# Altium project Drude.PrjPcb
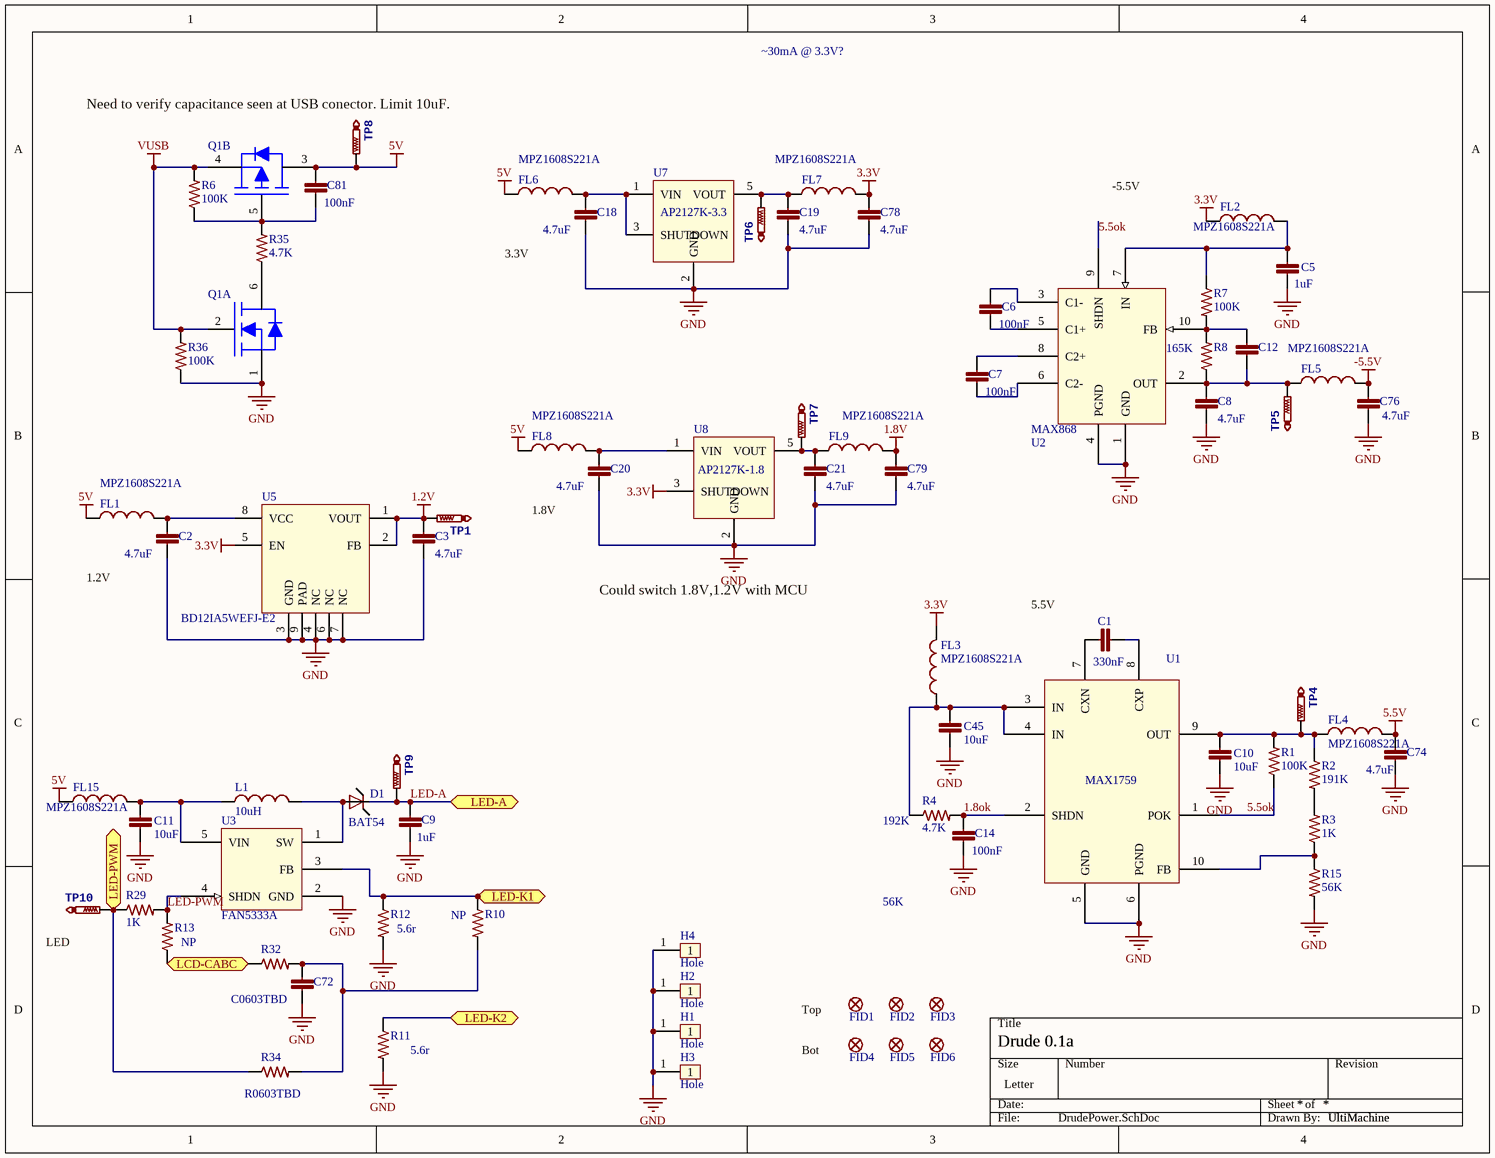
[diagram p0: DrudePower.SchDoc]
projectDesigner: UltiMachine; projectTitle: Drude; projectVersion: 0.1a
5 sheets, 217 parts. Net scope: flat (ports and power ports of the same name join across sheets).
Board file: Drude02.PcbDoc
Sheets:
  DrudePower.SchDoc
  LCD-Touch.SchDoc
  MCU.SchDoc
  TC358779XBG.SchDoc
  HDMI.SchDoc

## Sheet DrudePower.SchDoc
size Letter

### Parts
C1  330nF  [C0603]
C2  4.7uF  [C0603]
C3  4.7uF  [C0603]
C5  1uF  [C0603]
C6  100nF  [C0603]
C7  100nF  [C0603]
C8  4.7uF  [C0603]
C9  1uF  [C0805]
C10  10uF  [C0805]
C11  10uF  [C0805]
C12  (no value)  [C0603]
C14  100nF  [C0603]
C18  4.7uF  [C0603]
C19  4.7uF  [C0603]
C20  4.7uF  [C0603]
C21  4.7uF  [C0603]
C45  10uF  [C0805]
C72  C0603TBD  [C0603]
C74  4.7uF  [C0603]
C76  4.7uF  [C0603]
C78  4.7uF  [C0603]
C79  4.7uF  [C0603]
C81  100nF  [C0402]
D1  BAT54  [SOD523]
FID1  FIDUCIAL  [FIDUCIAL-1X2]  (value not drawn)
FID2  FIDUCIAL  [FIDUCIAL-1X2]  (value not drawn)
FID3  FIDUCIAL  [FIDUCIAL-1X2]  (value not drawn)
FID4  FIDUCIAL  [FIDUCIAL-1X2]  (value not drawn)
FID5  FIDUCIAL  [FIDUCIAL-1X2]  (value not drawn)
FID6  FIDUCIAL  [FIDUCIAL-1X2]  (value not drawn)
FL1  MPZ1608S221A  [C0603]
FL2  MPZ1608S221A  [C0603]
FL3  MPZ1608S221A  [C0603]
FL4  MPZ1608S221A  [C0603]
FL5  MPZ1608S221A  [C0603]
FL6  MPZ1608S221A  [C0603]
FL7  MPZ1608S221A  [C0603]
FL8  MPZ1608S221A  [C0603]
FL9  MPZ1608S221A  [C0603]
FL15  MPZ1608S221A  [C0603]
H1  Hole  [Standoff3mm]  (no BOM)
H2  Hole  [Standoff3mm]  (no BOM)
H3  Hole  [Standoff3mm]  (no BOM)
H4  Hole  [Standoff3mm]  (no BOM)
L1  10uH  [INDP3027X15L]
Q1  DMC2400UV  [SOT563-FL50P162X170-6N]  (value not drawn)  (parts A,B of 2)
R1  100K  [R0603]
R2  191K  [R0603]
R3  1K  [R0603]
R4  4.7K  [R0603]
R6  100K  [R0402]
R7  100K  [R0402]
R8  165K  [R0402]
R10  (no value)  [R0603]
R11  (no value)  [R0603]
R12  (no value)  [R0603]
R13  (no value)  [R0603]
R15  56K  [R0603]
R29  1K  [R0603]
R32  (no value)  [R0603]
R34  R0603TBD  [R0603]
R35  4.7K  [R0603]
R36  100K  [R0402]
TP1  TestPoint  [TP1-27]  (value not drawn)  (no BOM)
TP4  TestPoint  [TP1-27]  (value not drawn)  (no BOM)
TP5  TestPoint  [TP1-27]  (value not drawn)  (no BOM)
TP6  TestPoint  [TP1-27]  (value not drawn)  (no BOM)
TP7  TestPoint  [TP1-27]  (value not drawn)  (no BOM)
TP8  TestPoint  [TP1-27]  (value not drawn)  (no BOM)
TP9  TestPoint  [TP1-27]  (value not drawn)  (no BOM)
TP10  TestPoint  [TP1-27]  (value not drawn)  (no BOM)
U1  MAX1759  [TSSOP50P490X109-10L]
U2  MAX868  [TSSOP50P490X109-10L]
U3  FAN5333A  [SOT95P270X145-5L]
U5  BD12IA5WEFJ-E2  [TSOP-HTSOP-J8-127P600X100_HS-9M]
U7  AP2127K-3.3  [SOT23-5P285X140-5L]
U8  AP2127K-1.8  [SOT23-5P285X140-5L]

### Ports
LCD-CABC, LED-A, LED-K1, LED-K2, LED-PWM

### Nets
1.2V: C3.1 TP1.TP U5.1(VOUT) U5.2(FB)
1.8V: C79.1 FL9.2
3.3V: C78.1 FL2.1 FL3.2 FL7.2 U5.5(EN) U8.3(SHUTDOWN)
5.5V: C74.1 FL4.2
5V: C81.1 FL1.1 FL6.1 FL8.1 FL15.1 Q1.3(D2) TP8.TP
-5.5V: C76.1 FL5.2
GND: C2.2 C3.2 C5.2 C8.2 C9.2 C10.2 C11.2 C14.2 C18.2 C19.2 C20.2 C21.2 C45.2 C72.2 C74.2 C76.2 C78.2 C79.2 H1.1 H2.1 H3.1 H4.1 Q1.1(S1) R11.2 R12.2 R15.2 R36.1 U1.5(GND) U1.6(PGND) U2.1(GND) U2.4(PGND) U3.2(GND) U5.3(GND) U5.4(NC) U5.6(NC) U5.7(NC) U5.9(PAD) U7.2(GND) U8.2(GND)
VUSB: Q1.2(G1) Q1.4(S2) R6.2 R36.2
1.8ok: C14.1 R4.2 U1.2(SHDN)
5.5ok: R1.1 U1.1(POK) U2.9(SHDN)
LED-A: C9.1 D1.C TP9.TP ; port LED-A
LED-K1: R10.1 R12.1 U3.3(FB) ; port LED-K1
LED-K2: R11.1 ; port LED-K2
LED-PWM: R13.2 R29.2 U3.4(SHDN)
NetC1_1: C1.1 U1.7(CXN)
NetC1_2: C1.2 U1.8(CXP)
NetC2_1: C2.1 FL1.2 U5.8(VCC)
NetC5_1: C5.1 FL2.2 R7.1 U2.7(IN)
NetC6_1: C6.1 U2.3(C1-)
NetC6_2: C6.2 U2.5(C1+)
NetC7_1: C7.1 U2.8(C2+)
NetC7_2: C7.2 U2.6(C2-)
NetC8_1: C8.1 C12.2 FL5.1 R8.1 TP5.TP U2.2(OUT)
NetC10_1: C10.1 FL4.1 R1.2 R2.1 TP4.TP U1.9(OUT)
NetC11_1: C11.1 FL15.2 L1.1 U3.5(VIN)
NetC12_1: C12.1 R7.2 R8.2 U2.10(FB)
NetC18_1: C18.1 FL6.2 U7.1(VIN) U7.3(SHUTDOWN)
NetC19_1: C19.1 FL7.1 TP6.TP U7.5(VOUT)
NetC20_1: C20.1 FL8.2 U8.1(VIN)
NetC21_1: C21.1 FL9.1 TP7.TP U8.5(VOUT)
NetC45_1: C45.1 FL3.1 R4.1 U1.3(IN) U1.4(IN)
NetC72_1: C72.1 R10.2 R32.2 R34.2
NetC81_2: C81.2 Q1.5(G2) R6.1 R35.2
NetD1_A: D1.A L1.2 U3.1(SW)
NetJ5_32: R13.1 R32.1 ; port LCD-CABC
NetQ1_6: Q1.6(D1) R35.1
NetR2_2: R2.2 R3.2
NetR3_1: R3.1 R15.1 U1.10(FB)
NetR29_1: R29.1 R34.1 TP10.TP ; port LED-PWM

### Notes on the sheet
- ~30mA @ 3.3V?
- Need to verify capacitance seen at USB conector. Limit 10uF.
- -5.5V
- 3.3V
- 1.8V
- 1.2V
- Could switch 1.8V,1.2V with MCU
- 5.5V
- (near R4) 192K
- 56K
- LED
- (near R13) NP
- (near R12) 5.6r
- (near R10) NP
- Top
- (near R11) 5.6r
- Bot

### Library data of the parts
C1 = C1608X7R1H334K080AC: CAP CER 0603 330nF 50V 10% X7R; LastRevisionNote: ImportComponents; Published: 23-Apr-2014; Publisher: UltiMachine; LastRevisionDate: 23-Apr-2014; ManufacturerPartNumber: C1608X7R1H334K080AC; VALUE: 330nF
C2 C3 C8 C18-C21 C74 C76 C78 C79 = GRM188R61A475KE15D: CAP CER 4.7UF 10V X5R 0603; LastRevisionNote: ImportComponents; Published: 23-Apr-2014; Publisher: UltiMachine; LastRevisionDate: 23-Apr-2014; ManufacturerPartNumber: GRM188R61A475KE15D; VALUE: 4.7uF
C5 = CC0603ZRY5V6BB105: CAP CER 0603 1uF 10V Y5V; LastRevisionNote: ImportComponents; Published: 23-Apr-2014; Publisher: UltiMachine; LastRevisionDate: 23-Apr-2014; ManufacturerPartNumber: CC0603ZRY5V6BB105; VALUE: 1uF
C6 C7 C14 = C0603C104K5RACTU: CAP CER 0603 100nF 50V 10% X7R; LastRevisionNote: ImportComponents; Published: 23-Apr-2014; Publisher: UltiMachine; LastRevisionDate: 23-Apr-2014; ManufacturerPartNumber: C0603C104K5RACTU; VALUE: 100nF
C9 = GRM21BR71H105KA12L: CAP CER 0805 1uF 50V 10% X7R; LastRevisionNote: ImportComponents; Published: 23-Apr-2014; Publisher: UltiMachine; LastRevisionDate: 23-Apr-2014; ManufacturerPartNumber: GRM21BR71H105KA12L; VALUE: 1uF
C10 C11 C45 = C0805C106K8PACTU: CAP CER 0805 10uF 10V 10% X5R; LastRevisionNote: ImportComponents; Published: 23-Apr-2014; Publisher: UltiMachine; LastRevisionDate: 23-Apr-2014; ManufacturerPartNumber: C0805C106K8PACTU; VALUE: 10uF
C12 = Capacitor: Capacitor Non Polarized; LastRevisionNote: ImportComponents; Published: 23-Apr-2014; Publisher: UltiMachine; LastRevisionDate: 23-Apr-2014
C72 = C0603TBD: Capacitor Non Polarized; LastRevisionNote: ImportComponents; Published: 23-Apr-2014; Publisher: UltiMachine; LastRevisionDate: 23-Apr-2014; VALUE: C0603TBD
C81 = GRM155R71C104KA88D: CAP CER 0402 100nF 16V 10% X7R; LastRevisionNote: ImportComponents; Published: 23-Apr-2014; Publisher: UltiMachine; LastRevisionDate: 23-Apr-2014; ManufacturerPartNumber: GRM155R71C104KA88D; VALUE: 100nF
D1 = BAT54XV2: Diode Schottky 30V 200mA
FID1-FID6 = FIDUCIAL: LastRevisionNote: ImportComponents; Published: 23-Apr-2014; Publisher: UltiMachine; LastRevisionDate: 23-Apr-2014
FL1-FL9 FL15 = MPZ1608S221A: Ferrite; LastRevisionNote: ImportComponents; Published: 23-Apr-2014; Publisher: UltiMachine; LastRevisionDate: 23-Apr-2014; Value: MPZ1608S221A
H1-H4 = Standoff3mm: Mechanical - Top connect
L1 = SRN3015-100M: Ind 10uH 1A
Q1 = DMC2400UV: Mosfet Complementary Pair N +P
R1 = RC0603FR-07100KL: RES 100K OHM 1/10W 1% 0603 SMD; LastRevisionNote: ImportComponents; Published: 23-Apr-2014; Publisher: UltiMachine; LastRevisionDate: 23-Apr-2014; ManufacturerPartNumber: RC0603FR-07100KL; VALUE: 100K
R2 = RC0603FR-07191KL: RES 191K OHM 1% 1/10W 0603 SMD; LastRevisionNote: ImportComponents; Published: 23-Apr-2014; Publisher: UltiMachine; LastRevisionDate: 23-Apr-2014; ManufacturerPartNumber: RC0603FR-07191KL; VALUE: 191K
R3 R29 = ERJ-3EKF1001V: RES 0603 1K 100mW 1%; LastRevisionNote: ImportComponents; Published: 23-Apr-2014; Publisher: UltiMachine; LastRevisionDate: 23-Apr-2014; ManufacturerPartNumber: ERJ-3EKF1001V; VALUE: 1K
R4 R35 = ERJ3EKF4701V: RES 0603 4.7K 100mW 1%; LastRevisionNote: ImportComponents; Published: 23-Apr-2014; Publisher: UltiMachine; LastRevisionDate: 23-Apr-2014; ManufacturerPartNumber: ERJ3EKF4701V; VALUE: 4.7K
R6 R7 R36 = RC0402FR-07100KL: RES 100K OHM 1% 1/16W 0402; LastRevisionNote: ImportComponents; Published: 23-Apr-2014; Publisher: UltiMachine; LastRevisionDate: 23-Apr-2014; VALUE: 100K
R8 = CRCW0402165KFKED: RES 165K OHM 1% 1/16W 0402; LastRevisionNote: ImportComponents; Published: 23-Apr-2014; Publisher: UltiMachine; LastRevisionDate: 23-Apr-2014; VALUE: 165K
R10-R13 R32 = Resistor: LastRevisionNote: ImportComponents; Published: 23-Apr-2014; Publisher: UltiMachine; LastRevisionDate: 23-Apr-2014
R15 = RC0603FR-0756KL: RES 56K OHM 1% 1/10W 0603 56K; LastRevisionNote: ImportComponents; Published: 23-Apr-2014; Publisher: UltiMachine; LastRevisionDate: 23-Apr-2014; ManufacturerPartNumber: RC0603FR-0756KL; VALUE: 56K
R34 = R0603TBD: Resistor; LastRevisionNote: ImportComponents; Published: 23-Apr-2014; Publisher: UltiMachine; LastRevisionDate: 23-Apr-2014; VALUE: R0603TBD
TP1 TP4-TP10 = TestPoint: Test Point; LastRevisionNote: ImportComponents; Published: 23-Apr-2014; Publisher: UltiMachine; LastRevisionDate: 23-Apr-2014
U1 = MAX1759: Buck/Boost Regulating Charge Pump
U2 = MAX868: Regulated -2x Inverting Charge Pump
U3 = FAN5333: LED Driver w/ integrated switch
U5 = BD12IA5WEFJ-E2: LDO Regulator 500mA 1.2V
U7 = AP2127K-3.3TRG1: LDO 3.3V 0.3A SOT25
U8 = AP2127K-1.8TRG1: LDO 1.8V 0.3A SOT25

## Sheet LCD-Touch.SchDoc
size Letter
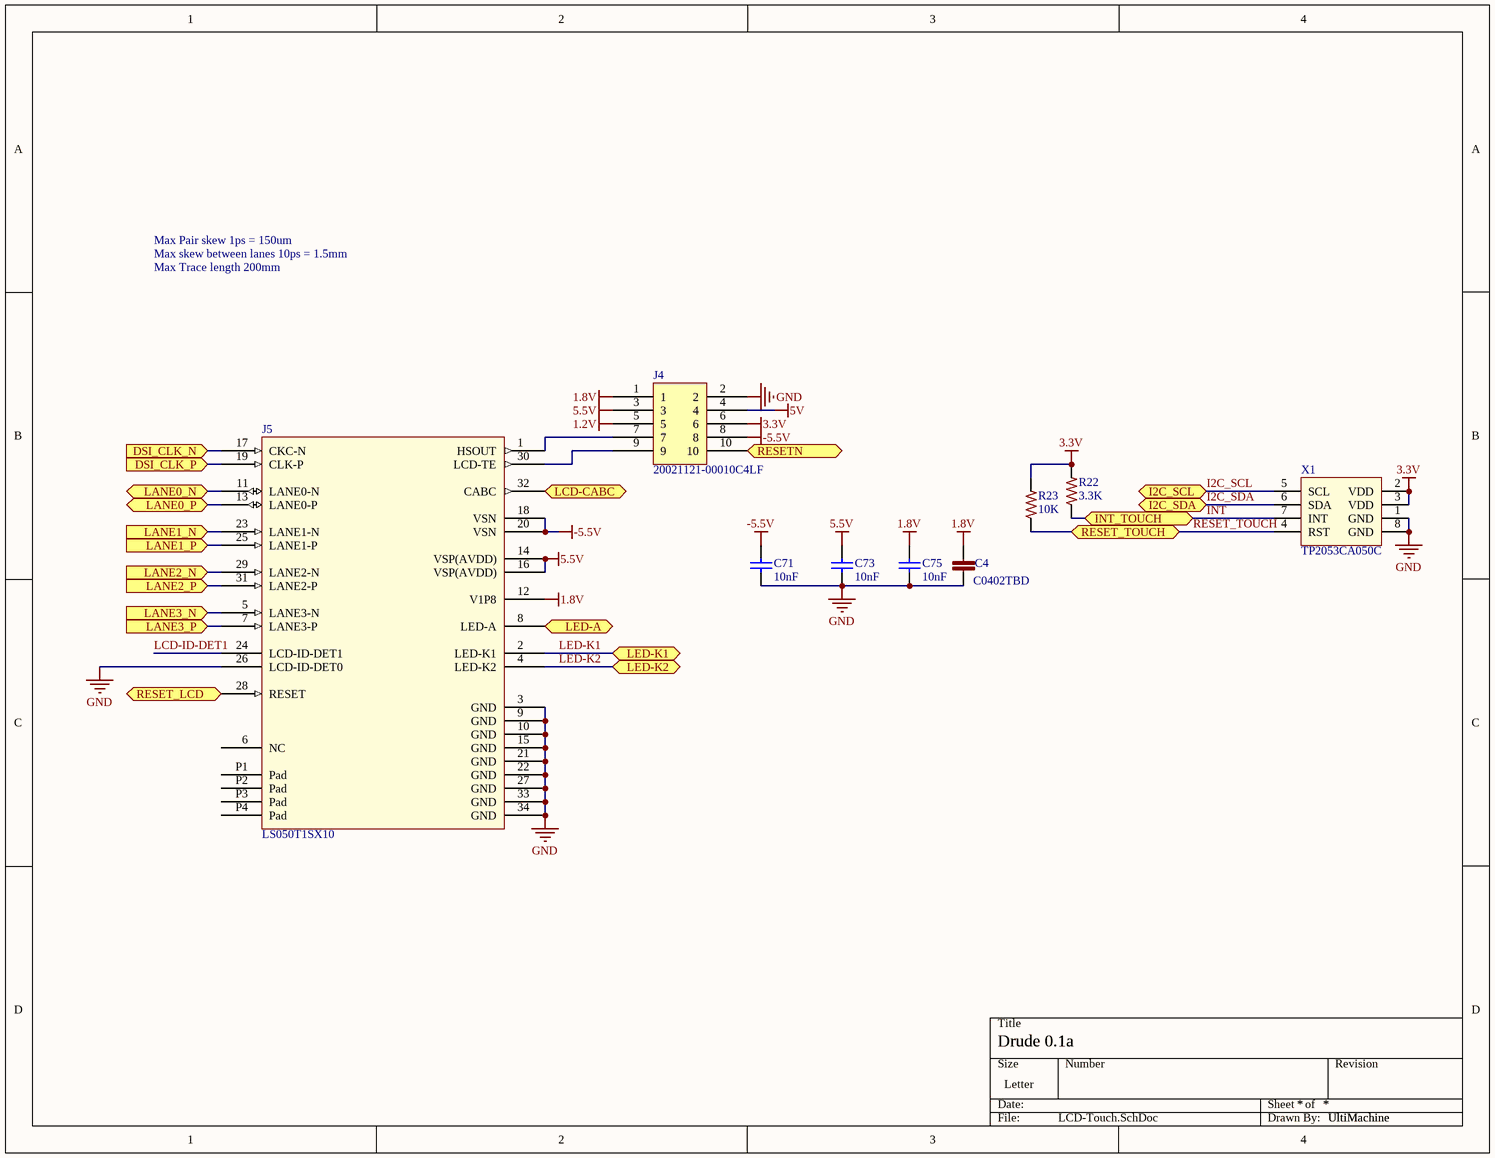
[diagram p1: LCD-Touch.SchDoc]

### Parts
C4  C0402TBD  [C0402]
C71  10nF  [C0402]
C73  10nF  [C0402]
C75  10nF  [C0402]
J4  20021121-00010C4LF  [FTSH-105-XX-X-DV]
J5  LS050T1SX10  [504208-3410]
R22  3.3K  [R0603]
R23  10K  [R0402]
X1  TP2053CA050C  [FFC8x05-top]

### Ports
DSI_CLK_N (in), DSI_CLK_P (in), I2C_SCL, I2C_SDA, INT_TOUCH, LANE0_N (bidir), LANE0_P (bidir), LANE1_N (in), LANE1_P (in), LANE2_N (in), LANE2_P (in), LANE3_N (in), LANE3_P (in), LCD-CABC, LED-A, LED-K1, LED-K2, RESET_LCD, RESET_TOUCH, RESETN

### Nets
1.2V: J4.5
1.8V: C4.1 C75.2 J4.1 J5.12(V1P8)
3.3V: J4.6 R22.2 R23.2 X1.2(VDD) X1.3(VDD)
5.5V: C73.2 J4.3 J5.14(VSP(AVDD)) J5.16(VSP(AVDD))
5V: J4.4
-5.5V: C71.2 J4.8 J5.18(VSN) J5.20(VSN)
GND: C4.2 C71.1 C73.1 C75.1 J4.2 J5.3(GND) J5.9(GND) J5.10(GND) J5.15(GND) J5.21(GND) J5.22(GND) J5.26(LCD-ID-DET0) J5.27(GND) J5.33(GND) J5.34(GND) X1.1(GND) X1.8(GND)
DSI_CLK_N: J5.17(CKC-N) ; port DSI_CLK_N
DSI_CLK_P: J5.19(CLK-P) ; port DSI_CLK_P
I2C_SCL: X1.5(SCL) ; port I2C_SCL
I2C_SDA: X1.6(SDA) ; port I2C_SDA
INT: R22.1 X1.7(INT) ; port INT_TOUCH
LANE0_N: J5.11(LANE0-N) ; port LANE0_N
LANE0_P: J5.13(LANE0-P) ; port LANE0_P
LANE1_N: J5.23(LANE1-N) ; port LANE1_N
LANE1_P: J5.25(LANE1-P) ; port LANE1_P
LANE2_N: J5.29(LANE2-N) ; port LANE2_N
LANE2_P: J5.31(LANE2-P) ; port LANE2_P
LANE3_N: J5.5(LANE3-N) ; port LANE3_N
LANE3_P: J5.7(LANE3-P) ; port LANE3_P
LCD-ID-DET1: J5.24(LCD-ID-DET1)
LED-A: J5.8(LED-A) ; port LED-A
LED-K1: J5.2(LED-K1) ; port LED-K1
LED-K2: J5.4(LED-K2) ; port LED-K2
RESET_TOUCH: R23.1 X1.4(RST) ; port RESET_TOUCH
NetJ4_7: J4.7 J5.1(HSOUT)
NetJ4_9: J4.9 J5.30(LCD-TE)
NetJ4_10: J4.10 ; port RESETN
NetJ5_28: J5.28(RESET) ; port RESET_LCD
NetJ5_32: J5.32(CABC) ; port LCD-CABC

Not connected (* = marked no-connect by the designer): J5 6(NC) P1(Pad) P2(Pad) P3(Pad) P4(Pad)

### Notes on the sheet
- Max Pair skew 1ps = 150um
- Max skew between lanes 10ps = 1.5mm
- Max Trace length 200mm

### Library data of the parts
C4 = C0402TBD: Capacitor Non Polarized; LastRevisionNote: ImportComponents; Published: 23-Apr-2014; Publisher: UltiMachine; VALUE: C0402TBD; LastRevisionDate: 23-Apr-2014
C71 C73 C75 = GRM155R71H103JA88D: CAP CER 10nF 50V X7R 0402; MFR: Murata; Part Description: CAP CER 10000PF 50V X7R 0402; Tolerance: 10%; Voltage: 6.3VDC; Value: 0.01uF 50V; Published: 10 - Dec - 2014; LatestRevisionDate: 10 - Dec - 2014; LatestRevisionNote: Ultimachine Footprint Added; Publisher: Ultimachine; Component Type: Chip Capacitor; MFR Part #: GRM155R71H103JA88D; Mounting Type: SMT 0402; Datasheet: http://search.murata.co.jp/Ceramy/image/img/A01X/G101/ENG/GRM155R71H103JA88-01.pdf; Height: 0.5 ±0.05mm; Digikey #: 490-7763-1-ND; PackageReference: 0402
J4 = ARM Cortex JTAG-DEBUG Header
J5 = LS050T1SX10: 5"HD LCD Module connector
R22 = ERJ-3GEYJ332V: RES 0603 3.3K 100mW 1%; ManufacturerPartNumber: ERJ-3EKF1002V; LastRevisionNote: ImportComponents; Published: 23-Apr-2014; Publisher: UltiMachine; LastRevisionDate: 23-Apr-2014; VALUE: 3.3K
R23 = RC0402FR-0710KP: RES SMD 10K OHM 1% 1/16W 0402; LastRevisionNote: ImportComponents; Published: 23-Apr-2014; Publisher: UltiMachine; LastRevisionDate: 23-Apr-2014; ManufacturerPartNumber: RC0402FR-0710KP; VALUE: 10K
X1 = TP2053CA050C: UltiMachine 5" HD Touch Interface

## Sheet MCU.SchDoc
size Letter
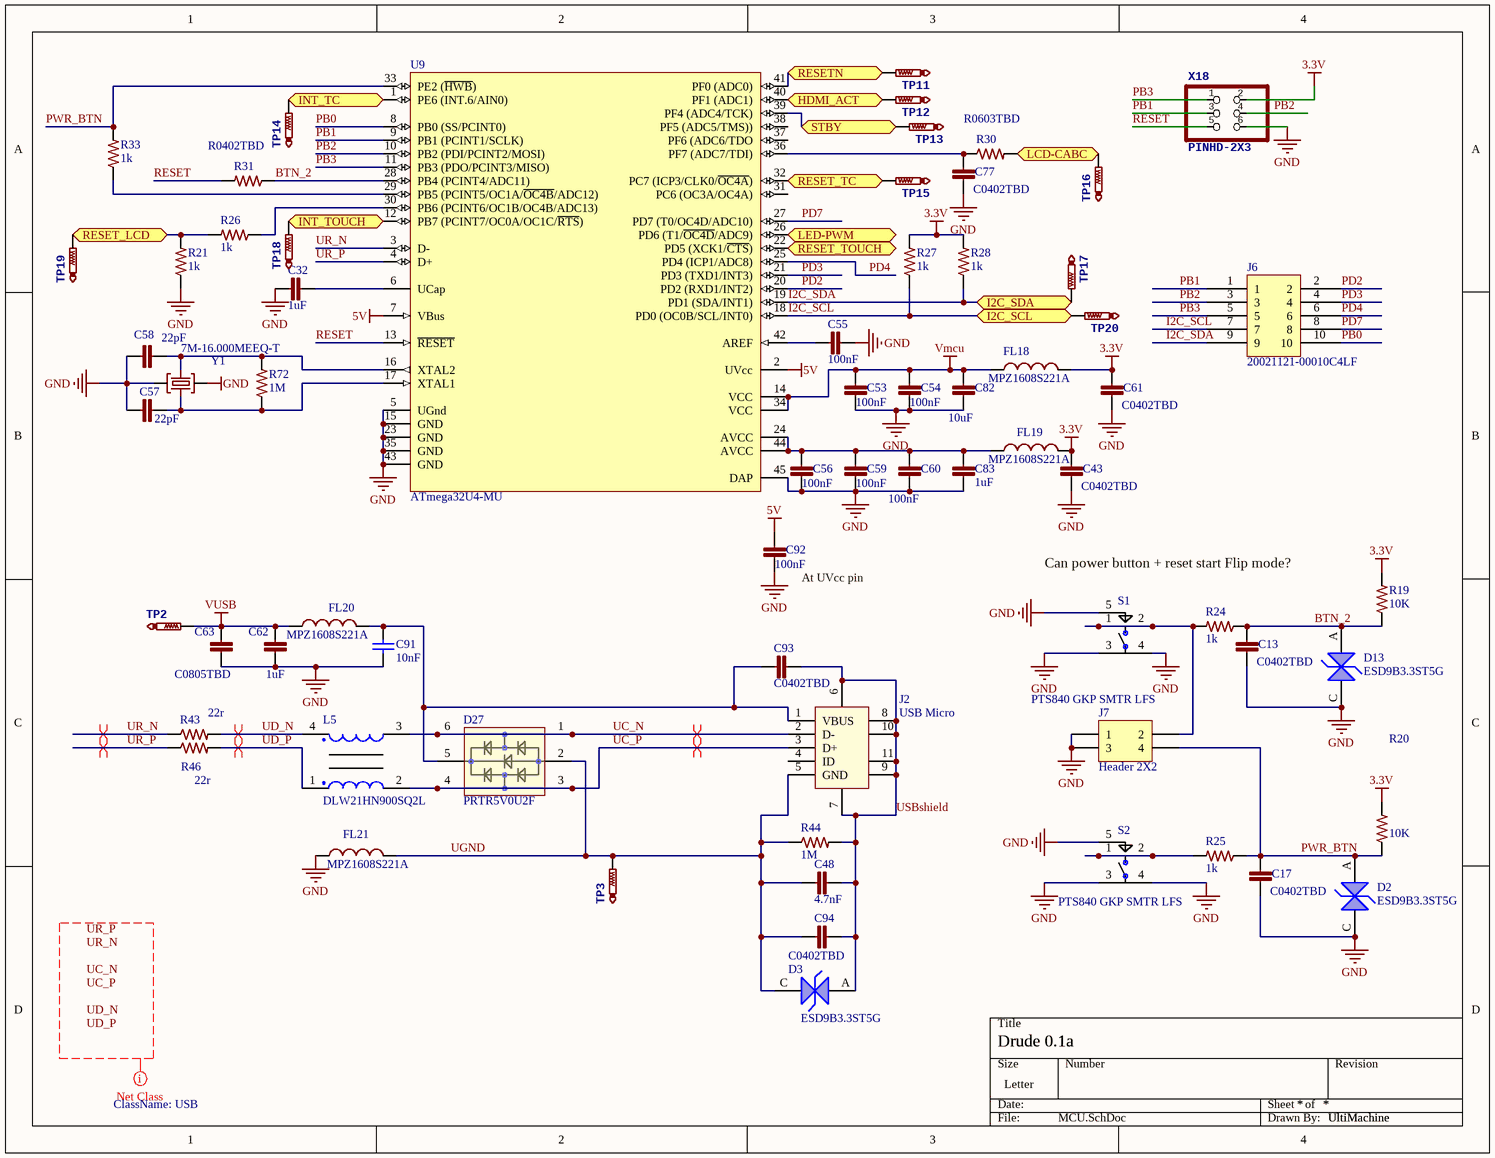
[diagram p2: MCU.SchDoc]

### Parts
C13  C0402TBD  [C0402]
C17  C0402TBD  [C0402]
C32  1uF  [C0402]
C43  C0402TBD  [C0402]
C48  4.7nF  [C0402]
C53  100nF  [C0402]
C54  100nF  [C0402]
C55  100nF  [C0402]
C56  100nF  [C0402]
C57  22pF  [C0402]
C58  22pF  [C0402]
C59  100nF  [C0402]
C60  100nF  [C0402]
C61  C0402TBD  [C0402]
C62  1uF  [C0603]
C63  C0805TBD  [C0805]
C77  C0402TBD  [C0402]
C82  10uF  [C0805]
C83  1uF  [C0402]
C91  10nF  [C0402]
C92  100nF  [C0402]
C93  C0402TBD  [C0402]
C94  C0402TBD  [C0402]
D2  ESD9B3.3ST5G  [SOD923-100X40-2N]
D3  ESD9B3.3ST5G  [SOD923-100X40-2N]
D13  ESD9B3.3ST5G  [SOD923-100X40-2N]
D27  PRTR5V0U2F  [SOT886]
FL18  MPZ1608S221A  [C0603]
FL19  MPZ1608S221A  [C0603]
FL20  MPZ1608S221A  [C0603]
FL21  MPZ1608S221A  [C0603]
J2  USB Micro  [10118194-0001LF]
J6  20021121-00010C4LF  [FTSH-105-XX-X-DV]
J7  Header 2X2  [HDR2X2]
L5  DLW21HN900SQ2L  [DLW21HN900SQ2L]
R19  10K  [R0402]
R20  10K  [R0402]
R21  1k  [R0402]
R24  1k  [R0402]
R25  1k  [R0402]
R26  1k  [R0402]
R27  1k  [R0402]
R28  1k  [R0402]
R30  R0603TBD  [R0603]
R31  R0402TBD  [R0402]
R33  1k  [R0402]
R43  22r  [R0402]
R44  1M  [R0402]
R46  22r  [R0402]
R72  1M  [R0402]
S1  PTS840 GKP SMTR LFS  [PTS840 GKP SMTR LFS]
S2  PTS840 GKP SMTR LFS  [PTS840 GKP SMTR LFS]
TP2  TestPoint  [TP1-27]  (value not drawn)  (no BOM)
TP3  TestPoint  [TP1-27]  (value not drawn)  (no BOM)
TP11  TestPoint  [TP1-27]  (value not drawn)  (no BOM)
TP12  TestPoint  [TP1-27]  (value not drawn)  (no BOM)
TP13  TestPoint  [TP1-27]  (value not drawn)  (no BOM)
TP14  TestPoint  [TP1-27]  (value not drawn)  (no BOM)
TP15  TestPoint  [TP1-27]  (value not drawn)  (no BOM)
TP16  TestPoint  [TP1-27]  (value not drawn)  (no BOM)
TP17  TestPoint  [TP1-27]  (value not drawn)  (no BOM)
TP18  TestPoint  [TP1-27]  (value not drawn)  (no BOM)
TP19  TestPoint  [TP1-27]  (value not drawn)  (no BOM)
TP20  TestPoint  [TP1-27]  (value not drawn)  (no BOM)
U9  ATmega32U4-MU  [44PW_L]
X18  PINHD-2X3  [2X03]
Y1  7M-16.000MEEQ-T  [CRYS320250]

### Ports
HDMI_ACT, I2C_SCL, I2C_SDA, INT_TC, INT_TOUCH, LCD-CABC, LED-PWM, RESET_LCD, RESET_TC, RESET_TOUCH, RESETN, STBY

### Nets
3.3V: C43.1 C61.2 FL18.2 FL19.2 R19.2 R20.2 R27.2 R28.2 X18.2
5V: C92.1 U9.2(UVcc) U9.7(VBus)
GND: C13.2 C17.2 C32.2 C43.2 C53.2 C54.2 C55.2 C56.2 C57.2 C58.2 C59.2 C60.2 C61.1 C62.2 C63.2 C77.2 C82.2 C83.2 C91.2 C92.2 D2.C D13.C FL21.1 J7.1 J7.3 R21.1 S1.3 S1.4 S1.5 S2.3 S2.4 S2.5 U9.5(UGnd) U9.15(GND) U9.23(GND) U9.35(GND) U9.43(GND) U9.45(DAP) X18.6 Y1.2(GND) Y1.4(GND)
Vmcu: C53.1 C54.1 C82.1 FL18.1 U9.14(VCC) U9.34(VCC)
VUSB: C62.1 C63.1 FL20.1 TP2.TP
BTN_2: C13.1 D13.A R19.1 R24.1 R31.1 U9.28(PB4_(PCINT4/ADC11))
I2C_SCL: J6.7 R27.1 TP20.TP U9.18(PD0_(OC0B/SCL/INT0)) ; port I2C_SCL
I2C_SDA: J6.9 R28.1 TP17.TP U9.19(PD1_(SDA/INT1)) ; port I2C_SDA
INT: TP18.TP U9.12(PB7_(PCINT7/OC0A/OC1C/~{RTS})) ; port INT_TOUCH
PB0: J6.10 U9.8(PB0_(SS/PCINT0))
PB1: J6.1 U9.9(PB1_(PCINT1/SCLK)) X18.3
PB2: J6.3 U9.10(PB2_(PDI/PCINT2/MOSI)) X18.4
PB3: J6.5 U9.11(PB3_(PDO/PCINT3/MISO)) X18.1
PD2: J6.2 U9.20(PD2_(RXD1/INT2))
PD3: J6.4 U9.21(PD3_(TXD1/INT3))
PD4: J6.6 U9.25(PD4_(ICP1/ADC8))
PD7: J6.8 U9.27(PD7_(T0/OC4D/ADC10))
PWR_BTN: C17.1 D2.A J7.4 R20.1 R25.1 R33.2 U9.33(PE2_(~{HWB}))
RESET: R31.2 U9.13(~{RESET}) X18.5
RESET_TOUCH: U9.22(PD5_(XCK1/~{CTS})) ; port RESET_TOUCH
UC_N: D27.1 D27.6 J2.2(D-) L5.3
UC_P: D27.3 D27.4 J2.3(D+) L5.2
UD_N: L5.4 R43.2
UD_P: L5.1 R46.2
UGND: C48.2 C94.2 D3.C D27.2 FL21.2 J2.5(GND) R44.1 TP3.TP
UR_N: R43.1 U9.3(D-)
UR_P: R46.1 U9.4(D+)
USBshield: C48.1 C93.1 C94.1 D3.A J2.6 J2.7 J2.8 J2.9 J2.10 J2.11 R44.2
NetC32_1: C32.1 U9.6(UCap)
NetC55_1: C55.1 U9.42(AREF)
NetC56_1: C56.1 C59.1 C60.1 C83.1 FL19.1 U9.24(AVCC) U9.44(AVCC)
NetC57_1: C57.1 R72.1 U9.17(XTAL1) Y1.1(C1)
NetC58_1: C58.1 R72.2 U9.16(XTAL2) Y1.3(C2)
NetC77_1: C77.1 R30.1 U9.36(PF7_(ADC7/TDI))
NetC91_1: C91.1 C93.2 D27.5 FL20.2 J2.1(VBUS)
NetJ4_10: TP11.TP U9.41(PF0_(ADC0)) ; port RESETN
NetJ5_28: R21.2 R26.2 TP19.TP ; port RESET_LCD
NetJ5_32: R30.2 TP16.TP ; port LCD-CABC
NetJ7_2: J7.2 R24.2 S1.1 S1.2
NetR25_2: R25.2 S2.1 S2.2
NetR26_1: R26.1 U9.30(PB6_(PCINT6/OC1B/OC4B/ADC13))
NetR29_1: U9.26(PD6_(T1/~{OC4D}/ADC9)) ; port LED-PWM
NetR33_1: R33.1 U9.29(PB5_(PCINT5/OC1A/~{OC4B}/ADC12))
NetTP12_TP: TP12.TP U9.40(PF1_(ADC1)) ; port HDMI_ACT
NetTP13_TP: TP13.TP U9.39(PF4_(ADC4/TCK)) ; port STBY
NetTP14_TP: TP14.TP U9.1(PE6_(INT.6/AIN0)) ; port INT_TC
NetTP15_TP: TP15.TP U9.32(PC7_(ICP3/CLK0/~{OC4A})) ; port RESET_TC

Not connected (* = marked no-connect by the designer): J2 4(ID); U9 31(PC6_(OC3A/OC4A)) 37(PF6_(ADC6/TDO) 38(PF5_(ADC5/TMS)))

### Layout directives
differential pair: UC_N, UC_P, UD_N, UD_P, UR_N, UR_P
net class USB: UC_N, UC_P, UD_N, UD_P, UR_N, UR_P

### Notes on the sheet
- Can power button + reset start Flip mode?
- (near C92) At UVcc pin
- Labels drawn without touching a wire or pin: UC_N, UC_P, UD_N, UD_P, UR_N, UR_P

### Library data of the parts
C13 C17 C43 C61 C77 C93 C94 = C0402TBD: as C4 on sheet LCD-Touch; Published: 23-Apr-2014; Publisher: UltiMachine; VALUE: C0402TBD; LastRevisionDate: 23-Apr-2014
C32 C83 = GRM155R60J105KE19D: CAP CER 0402 1uF 6.3V 10% X5R; LastRevisionNote: ImportComponents; Published: 23-Apr-2014; Publisher: UltiMachine; LastRevisionDate: 23-Apr-2014; ManufacturerPartNumber: GRM155R60J105KE19D; VALUE: 1uF
C48 = CC0402KRX7R8BB472: CAP CER 0402 4.7nF 25V 10% X7R; LastRevisionNote: ImportComponents; Published: 23-Apr-2014; Publisher: UltiMachine; VALUE: 4.7nF; LastRevisionDate: 23-Apr-2014; ManufacturerPartNumber: CC0402KRX7R8BB472
C53-C56 C59 C60 C92 = GRM155R71C104KA88D: as C81 on sheet DrudePower; Published: 23-Apr-2014; Publisher: UltiMachine; LastRevisionDate: 23-Apr-2014; ManufacturerPartNumber: GRM155R71C104KA88D; VALUE: 100nF
C57 C58 = 04025A220JAT2A: CAP CER 0402 22pF 50V 5% C0G; LastRevisionNote: ImportComponents; Published: 23-Apr-2014; Publisher: UltiMachine; LastRevisionDate: 23-Apr-2014; ManufacturerPartNumber: 04025A220JAT2A; VALUE: 22pF
C62 = CC0603ZRY5V6BB105: as C5 on sheet DrudePower; Published: 23-Apr-2014; Publisher: UltiMachine; LastRevisionDate: 23-Apr-2014; ManufacturerPartNumber: CC0603ZRY5V6BB105; VALUE: 1uF
C63 = C0805TBD: Capacitor Non Polarized; LastRevisionNote: ImportComponents; Published: 23-Apr-2014; Publisher: UltiMachine; LastRevisionDate: 23-Apr-2014; VALUE: C0805TBD
C82 = C0805C106K8PACTU: as C10 on sheet DrudePower; Published: 23-Apr-2014; Publisher: UltiMachine; LastRevisionDate: 23-Apr-2014; ManufacturerPartNumber: C0805C106K8PACTU; VALUE: 10uF
C91 = GRM155R71H103JA88D: CAP CER 10nF 50V X7R 0402; MFR: Murata; Part Description: CAP CER 10000PF 50V X7R 0402; Value: 0.01uF 50V; Tolerance: 10%; Voltage: 6.3VDC; Published: 10 - Dec - 2014; Publisher: Ultimachine; LatestRevisionDate: 10 - Dec - 2014; LatestRevisionNote: Ultimachine Footprint Added; Component Type: Chip Capacitor; MFR Part #: GRM155R71H103JA88D; Mounting Type: SMT 0402; Datasheet: http://search.murata.co.jp/Ceramy/image/img/A01X/G101/ENG/GRM155R71H103JA88-01.pdf; Height: 0.5 ±0.05mm; Digikey #: 490-7763-1-ND; PackageReference: 0402
D2 D3 D13 = ESD9B3.3ST5G: 11.5 V 15 pF SMT Transient Voltage Suppressor - SOD-923
D27 = PRTR5V0U2F: Rail-to-rail ESD protection devices
FL18-FL21 = MPZ1608S221A: as FL1 on sheet DrudePower; Published: 23-Apr-2014; Publisher: UltiMachine; LastRevisionDate: 23-Apr-2014; Value: MPZ1608S221A
J2 = 10118194-0001LF: Conn Recept USB - micro B 2.0 5 Pos SMT, Rt Angle, Horizontal
J6 = ARM Cortex JTAG-DEBUG Header
J7 = Header 2X2: Header, 2-Pin, Dual row; LatestRevisionDate: 17-Jul-2002; LatestRevisionNote: Re-released for DXP Platform.; Publisher: Altium Limited
L5 = DLW21HN900SQ2L: Common Mode Chokes Dual 90Ohm 100MHz 330mA 350mOhm DCR SMD
R19 R20 = RC0402FR-0710KP: as R23 on sheet LCD-Touch; Published: 23-Apr-2014; Publisher: UltiMachine; LastRevisionDate: 23-Apr-2014; ManufacturerPartNumber: RC0402FR-0710KP; VALUE: 10K
R21 R24-R28 R33 = RK73H1ETTP1001F: RES 0402 1k 63mW 1%; LastRevisionNote: ImportComponents; Published: 23-Apr-2014; Publisher: UltiMachine; LastRevisionDate: 23-Apr-2014; VALUE: 1k
R30 = R0603TBD: as R34 on sheet DrudePower; Published: 23-Apr-2014; Publisher: UltiMachine; LastRevisionDate: 23-Apr-2014; VALUE: R0603TBD
R31 = R0402TBD: Resistor; LastRevisionNote: ImportComponents; Published: 23-Apr-2014; Publisher: UltiMachine; LastRevisionDate: 23-Apr-2014; VALUE: R0402TBD
R43 R46 = RC0402FR-0722RL: RES 0402 22r 63mW 1%; LastRevisionNote: ImportComponents; Published: 23-Apr-2014; Publisher: UltiMachine; LastRevisionDate: 23-Apr-2014; VALUE: 22r
R44 R72 = ERJ2GEJ105X: RES 0402 1M 100mW 5%; LastRevisionNote: ImportComponents; Published: 23-Apr-2014; Publisher: UltiMachine; LastRevisionDate: 23-Apr-2014; ManufacturerPartNumber: ERJ2GEJ105X; VALUE: 1M
S1 S2 = PTS840 GKP SMTR LFS: SWITCH TACTILE SPST-NO 0.05A 12V
TP2 TP3 TP11-TP20 = TestPoint: as TP1 on sheet DrudePower; Published: 23-Apr-2014; Publisher: UltiMachine; LastRevisionDate: 23-Apr-2014
U9 = MC-8B-ATM16U4-SQ45
X18 = PINHD-2X3: PIN HEADER; LastRevisionNote: ImportComponents; LastRevisionDate: 23-Apr-2014; Published: 23-Apr-2014; Publisher: UltiMachine
Y1 = 7M-16.000MEEQ-T: Crystal 16mHz 10ppm 10pF; LastRevisionNote: ImportComponents; LastRevisionDate: 23-Apr-2014; ManufacturerPartNumber: 7M-16.000MEEQ-T; Published: 23-Apr-2014; Publisher: UltiMachine

## Sheet TC358779XBG.SchDoc
size Letter
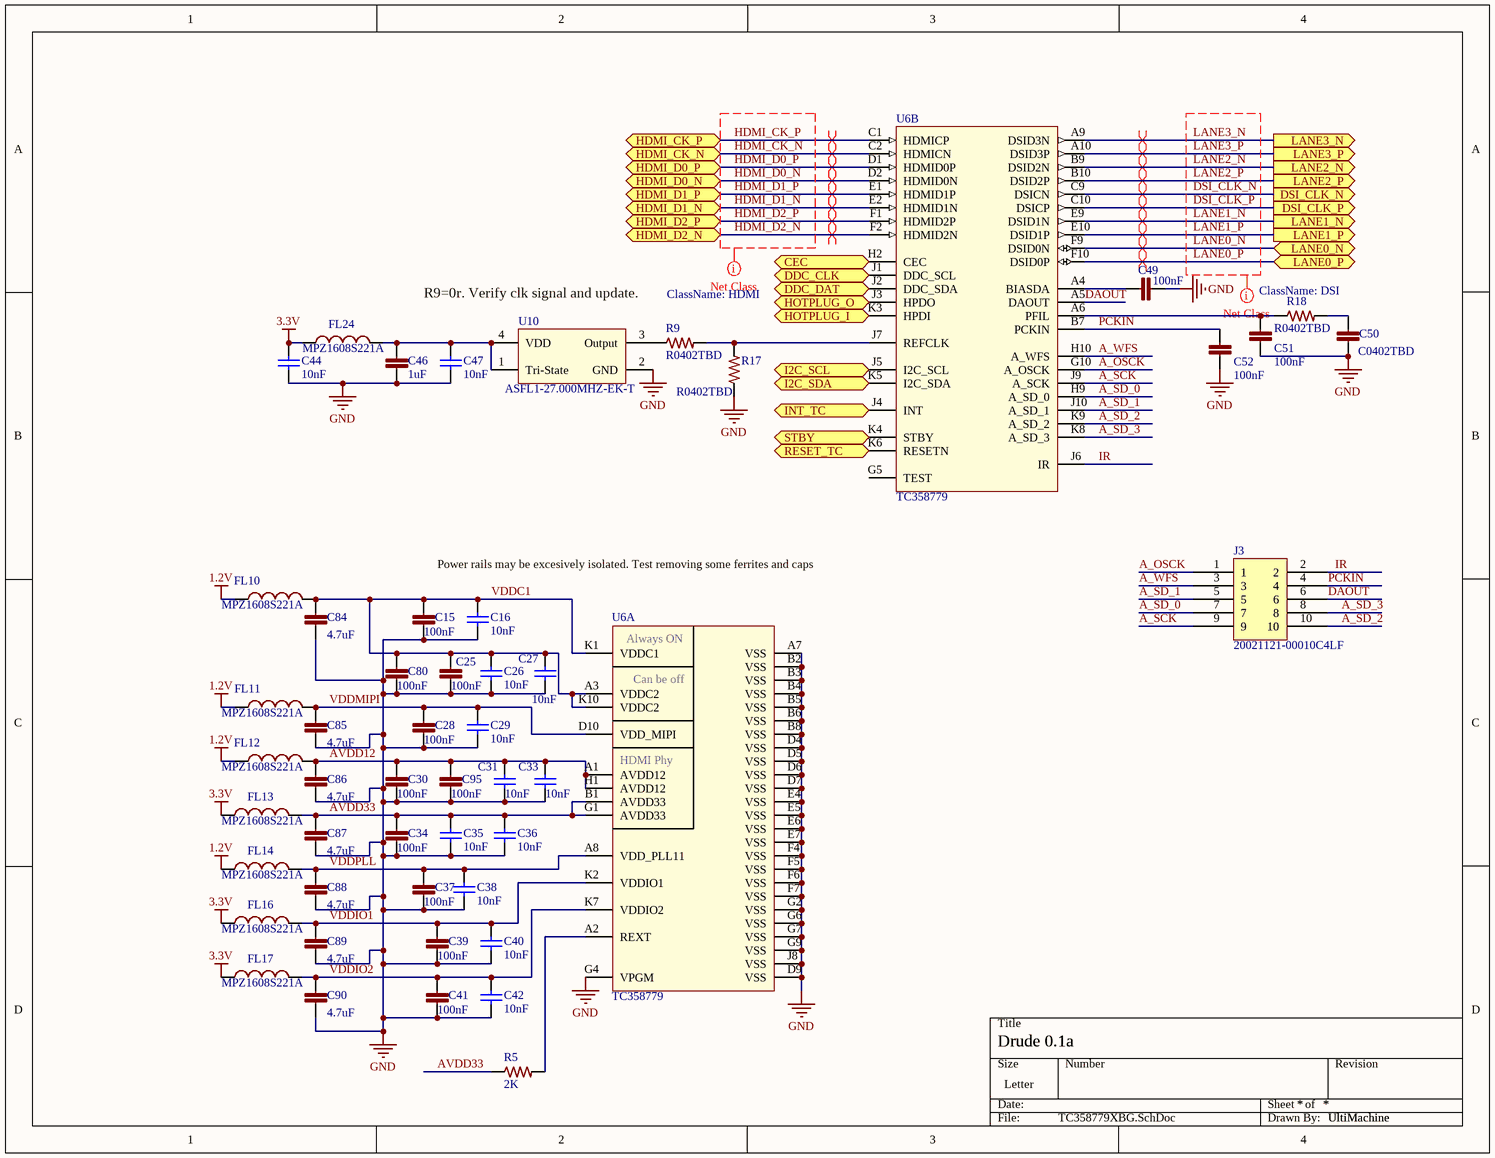
[diagram p3: TC358779XBG.SchDoc]

### Parts
C15  100nF  [C0402]
C16  10nF  [C0402]
C25  100nF  [C0402]
C26  10nF  [C0402]
C27  10nF  [C0402]
C28  100nF  [C0402]
C29  10nF  [C0402]
C30  100nF  [C0402]
C31  10nF  [C0402]
C33  10nF  [C0402]
C34  100nF  [C0402]
C35  10nF  [C0402]
C36  10nF  [C0402]
C37  100nF  [C0402]
C38  10nF  [C0402]
C39  100nF  [C0402]
C40  10nF  [C0402]
C41  100nF  [C0402]
C42  10nF  [C0402]
C44  10nF  [C0402]
C46  1uF  [C0402]
C47  10nF  [C0402]
C49  100nF  [C0402]
C50  C0402TBD  [C0402]
C51  100nF  [C0402]
C52  100nF  [C0402]
C80  100nF  [C0402]
C84  4.7uF  [C0603]
C85  4.7uF  [C0603]
C86  4.7uF  [C0603]
C87  4.7uF  [C0603]
C88  4.7uF  [C0603]
C89  4.7uF  [C0603]
C90  4.7uF  [C0603]
C95  100nF  [C0402]
FL10  MPZ1608S221A  [C0603]
FL11  MPZ1608S221A  [C0603]
FL12  MPZ1608S221A  [C0603]
FL13  MPZ1608S221A  [C0603]
FL14  MPZ1608S221A  [C0603]
FL16  MPZ1608S221A  [C0603]
FL17  MPZ1608S221A  [C0603]
FL24  MPZ1608S221A  [C0603]
J3  20021121-00010C4LF  [FTSH-105-XX-X-DV]
R5  2K  [R0402]
R9  R0402TBD  [R0402]
R17  R0402TBD  [R0402]
R18  R0402TBD  [R0402]
U6  TC358779  [BGA80-0707-065]  (parts A,B of 2)
U10  ASFL1-27.000MHZ-EK-T  [OSC-5x3.2x1.3]

### Ports
CEC, DDC_CLK, DDC_DAT, DSI_CLK_N (out), DSI_CLK_P (out), HDMI_CK_N, HDMI_CK_P, HDMI_D0_N, HDMI_D0_P, HDMI_D1_N, HDMI_D1_P, HDMI_D2_N, HDMI_D2_P, HOTPLUG_I, HOTPLUG_O, I2C_SCL, I2C_SDA, INT_TC, LANE0_N (bidir), LANE0_P (bidir), LANE1_N (out), LANE1_P (out), LANE2_N (out), LANE2_P (out), LANE3_N (out), LANE3_P (out), RESET_TC, STBY

### Nets
1.2V: FL10.1 FL11.1 FL12.1 FL14.1
3.3V: C44.2 FL13.1 FL16.1 FL17.1 FL24.2
GND: C15.2 C16.1 C25.2 C26.1 C27.1 C28.2 C29.1 C30.2 C31.1 C33.1 C34.2 C35.1 C36.1 C37.2 C38.1 C39.2 C40.1 C41.2 C42.1 C44.1 C46.2 C47.1 C49.2 C50.2 C51.2 C52.2 C80.2 C84.2 C85.2 C86.2 C87.2 C88.2 C89.2 C90.2 C95.2 R17.1 U6.A7(VSS) U6.B2(VSS) U6.B3(VSS) U6.B4(VSS) U6.B5(VSS) U6.B6(VSS) U6.B8(VSS) U6.D4(VSS) U6.D5(VSS) U6.D6(VSS) U6.D7(VSS) U6.D9(VSS) U6.E4(VSS) U6.E5(VSS) U6.E6(VSS) U6.E7(VSS) U6.F4(VSS) U6.F5(VSS) U6.F6(VSS) U6.F7(VSS) U6.G2(VSS) U6.G4(VPGM) U6.G6(VSS) U6.G7(VSS) U6.G9(VSS) U6.J8(VSS) U10.2(GND)
A_OSCK: J3.1 U6.G10(A_OSCK)
A_SCK: J3.9 U6.J9(A_SCK)
A_SD_0: J3.7 U6.H9(A_SD_0)
A_SD_1: J3.5 U6.J10(A_SD_1)
A_SD_2: J3.10 U6.K9(A_SD_2)
A_SD_3: J3.8 U6.K8(A_SD_3)
A_WFS: J3.3 U6.H10(A_WFS)
AVDD12: C30.1 C31.2 C33.2 C86.1 C95.1 FL12.2 U6.A1(AVDD12) U6.H1(AVDD12)
AVDD33: C34.1 C35.2 C36.2 C87.1 FL13.2 R5.1 U6.B1(AVDD33) U6.G1(AVDD33)
DAOUT: J3.6 U6.A5(DAOUT)
DSI_CLK_N: U6.C9(DSICN) ; port DSI_CLK_N
DSI_CLK_P: U6.C10(DSICP) ; port DSI_CLK_P
HDMI_CK_N: U6.C2(HDMICN) ; port HDMI_CK_N
HDMI_CK_P: U6.C1(HDMICP) ; port HDMI_CK_P
HDMI_D0_N: U6.D2(HDMID0N) ; port HDMI_D0_N
HDMI_D0_P: U6.D1(HDMID0P) ; port HDMI_D0_P
HDMI_D1_N: U6.E2(HDMID1N) ; port HDMI_D1_N
HDMI_D1_P: U6.E1(HDMID1P) ; port HDMI_D1_P
HDMI_D2_N: U6.F2(HDMID2N) ; port HDMI_D2_N
HDMI_D2_P: U6.F1(HDMID2P) ; port HDMI_D2_P
I2C_SCL: U6.J5(I2C_SCL) ; port I2C_SCL
I2C_SDA: U6.K5(I2C_SDA) ; port I2C_SDA
IR: J3.2 U6.J6(IR)
LANE0_N: U6.F9(DSID0N) ; port LANE0_N
LANE0_P: U6.F10(DSID0P) ; port LANE0_P
LANE1_N: U6.E9(DSID1N) ; port LANE1_N
LANE1_P: U6.E10(DSID1P) ; port LANE1_P
LANE2_N: U6.B9(DSID2N) ; port LANE2_N
LANE2_P: U6.B10(DSID2P) ; port LANE2_P
LANE3_N: U6.A9(DSID3N) ; port LANE3_N
LANE3_P: U6.A10(DSID3P) ; port LANE3_P
PCKIN: C52.1 J3.4 U6.B7(PCKIN)
VDDC1: C15.1 C16.2 C25.1 C26.2 C27.2 C80.1 C84.1 FL10.2 U6.A3(VDDC2) U6.K1(VDDC1) U6.K10(VDDC2)
VDDIO1: C39.1 C40.2 C89.1 FL16.2 U6.K2(VDDIO1)
VDDIO2: C41.1 C42.2 C90.1 FL17.2 U6.K7(VDDIO2)
VDDMIPI: C28.1 C29.2 C85.1 FL11.2 U6.D10(VDD_MIPI)
VDDPLL: C37.1 C38.2 C88.1 FL14.2 U6.A8(VDD_PLL11)
NetC23_1: U6.K3(HPDI) ; port HOTPLUG_I
NetC46_1: C46.1 C47.2 FL24.1 U10.1(Tri-State) U10.4(VDD)
NetC49_1: C49.1 U6.A4(BIASDA)
NetC50_1: C50.1 R18.2
NetC51_1: C51.1 R18.1 U6.A6(PFIL)
NetR5_2: R5.2 U6.A2(REXT)
NetR9_1: R9.1 U10.3(Output)
NetR9_2: R9.2 R17.2 U6.J7(REFCLK)
NetR14_1: U6.J1(DDC_SCL) ; port DDC_CLK
NetR16_1: U6.J2(DDC_SDA) ; port DDC_DAT
NetTP13_TP: U6.K4(STBY) ; port STBY
NetTP14_TP: U6.J4(INT) ; port INT_TC
NetTP15_TP: U6.K6(RESETN) ; port RESET_TC
NetU4_29: U6.H2(CEC) ; port CEC
NetU4_32: U6.J3(HPDO) ; port HOTPLUG_O

Not connected (* = marked no-connect by the designer): U6 G5(TEST)

### Layout directives
differential pair: DSI_CLK_N, DSI_CLK_P, HDMI_CK_N, HDMI_CK_P, HDMI_D0_N, HDMI_D0_P, HDMI_D1_N, HDMI_D1_P, HDMI_D2_N, HDMI_D2_P, LANE0_N, LANE0_P, LANE1_N, LANE1_P, LANE2_N, LANE2_P, LANE3_N, LANE3_P
net class DSI: DSI_CLK_N, DSI_CLK_P, LANE0_N, LANE0_P, LANE1_N, LANE1_P, LANE2_N, LANE2_P, LANE3_N, LANE3_P
net class HDMI: HDMI_CK_N, HDMI_CK_P, HDMI_D0_N, HDMI_D0_P, HDMI_D1_N, HDMI_D1_P, HDMI_D2_N, HDMI_D2_P

### Notes on the sheet
- R9=0r. Verify clk signal and update.
- Power rails may be excesively isolated. Test removing some ferrites and caps
- (in symbol TC358779, part A) Always ON; Can be off; HDMI Phy

### Library data of the parts
C15 C25 C28 C30 C34 C37 C39 C41 C49 C51 C52 C80 C95 = GRM155R71C104KA88D: as C81 on sheet DrudePower; Published: 23-Apr-2014; Publisher: UltiMachine; LastRevisionDate: 23-Apr-2014; ManufacturerPartNumber: GRM155R71C104KA88D; VALUE: 100nF
C16 C26 C27 C29 C31 C33 C35 C36 C38 C40 C42 C44 C47 = GRM155R71H103JA88D: as C71 on sheet LCD-Touch; Published: 10 - Dec - 2014; LatestRevisionDate: 10 - Dec - 2014; LatestRevisionNote: Ultimachine Footprint Added; Publisher: Ultimachine; Component Type: Chip Capacitor; MFR Part #: GRM155R71H103JA88D; Mounting Type: SMT 0402; Datasheet: http://search.murata.co.jp/Ceramy/image/img/A01X/G101/ENG/GRM155R71H103JA88-01.pdf; Height: 0.5 ±0.05mm; Digikey #: 490-7763-1-ND; PackageReference: 0402
C46 = GRM155R60J105KE19D: as C32 on sheet MCU; Published: 23-Apr-2014; Publisher: UltiMachine; LastRevisionDate: 23-Apr-2014; ManufacturerPartNumber: GRM155R60J105KE19D; VALUE: 1uF
C50 = C0402TBD: as C4 on sheet LCD-Touch; Published: 23-Apr-2014; Publisher: UltiMachine; LastRevisionDate: 23-Apr-2014; VALUE: C0402TBD
C84-C90 = GRM188R61A475KE15D: as C2 on sheet DrudePower; Published: 23-Apr-2014; Publisher: UltiMachine; LastRevisionDate: 23-Apr-2014; ManufacturerPartNumber: GRM188R61A475KE15D; VALUE: 4.7uF
FL10-FL14 FL16 FL17 FL24 = MPZ1608S221A: as FL1 on sheet DrudePower; Published: 23-Apr-2014; Publisher: UltiMachine; LastRevisionDate: 23-Apr-2014; Value: MPZ1608S221A
J3 = ARM Cortex JTAG-DEBUG Header
R5 = RC0402FR-072KL: RES SMD 2K OHM 1% 1/16W 0402; ManufacturerPartNumber: RC0402FR-0710KP; LastRevisionNote: ImportComponents; Published: 23-Apr-2014; Publisher: UltiMachine; LastRevisionDate: 23-Apr-2014; VALUE: 2K
R9 R17 R18 = R0402TBD: as R31 on sheet MCU; Published: 23-Apr-2014; Publisher: UltiMachine; LastRevisionDate: 23-Apr-2014; VALUE: R0402TBD
U10 = ASFL1-27.000MHZ-EK-T: OSC XO 27.000MHZ HCMOS TTL SMD

## Sheet HDMI.SchDoc
size Letter
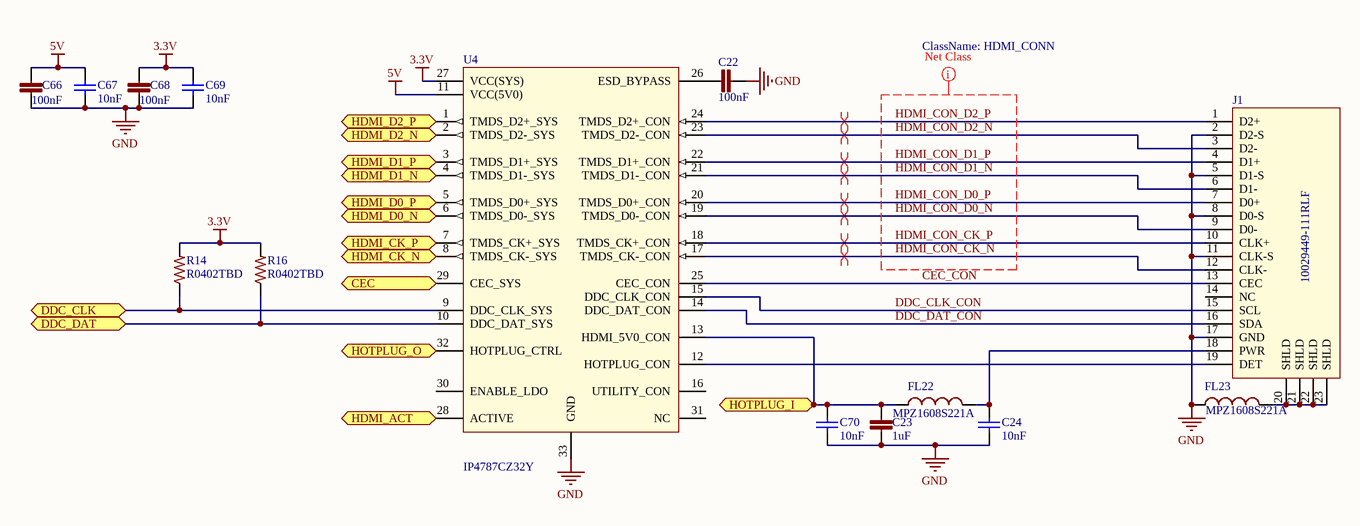
[diagram p4: HDMI.SchDoc]

### Parts
C22  100nF  [C0402]
C23  1uF  [C0402]
C24  10nF  [C0402]
C66  100nF  [C0402]
C67  10nF  [C0402]
C68  100nF  [C0402]
C69  10nF  [C0402]
C70  10nF  [C0402]
FL22  MPZ1608S221A  [C0603]
FL23  MPZ1608S221A  [C0603]
J1  10029449-111RLF  [10029449-111RLF]
R14  R0402TBD  [R0402]
R16  R0402TBD  [R0402]
U4  IP4787CZ32Y  [QFN32-HVQFN32]

### Ports
CEC, DDC_CLK, DDC_DAT, HDMI_ACT, HDMI_CK_N, HDMI_CK_P, HDMI_D0_N, HDMI_D0_P, HDMI_D1_N, HDMI_D1_P, HDMI_D2_N, HDMI_D2_P, HOTPLUG_I, HOTPLUG_O

### Nets
3.3V: C68.1 C69.2 R14.2 R16.2 U4.27(VCC(SYS))
5V: C66.1 C67.2 U4.11(VCC(5V0))
GND: C22.2 C23.2 C24.1 C66.2 C67.1 C68.2 C69.1 C70.1 FL23.1 J1.2(D2-S) J1.5(D1-S) J1.8(D0-S) J1.11(CLK-S) J1.17(GND) U4.33(GND)
CEC_CON: J1.13(CEC) U4.25(CEC_CON)
DDC_CLK_CON: J1.15(SCL) U4.15(DDC_CLK_CON)
DDC_DAT_CON: J1.16(SDA) U4.14(DDC_DAT_CON)
HDMI_CK_N: U4.8(TMDS_CK-_SYS) ; port HDMI_CK_N
HDMI_CK_P: U4.7(TMDS_CK+_SYS) ; port HDMI_CK_P
HDMI_CON_CK_N: J1.12(CLK-) U4.17(TMDS_CK-_CON)
HDMI_CON_CK_P: J1.10(CLK+) U4.18(TMDS_CK+_CON)
HDMI_CON_D0_N: J1.9(D0-) U4.19(TMDS_D0-_CON)
HDMI_CON_D0_P: J1.7(D0+) U4.20(TMDS_D0+_CON)
HDMI_CON_D1_N: J1.6(D1-) U4.21(TMDS_D1-_CON)
HDMI_CON_D1_P: J1.4(D1+) U4.22(TMDS_D1+_CON)
HDMI_CON_D2_N: J1.3(D2-) U4.23(TMDS_D2-_CON)
HDMI_CON_D2_P: J1.1(D2+) U4.24(TMDS_D2+_CON)
HDMI_D0_N: U4.6(TMDS_D0-_SYS) ; port HDMI_D0_N
HDMI_D0_P: U4.5(TMDS_D0+_SYS) ; port HDMI_D0_P
HDMI_D1_N: U4.4(TMDS_D1-_SYS) ; port HDMI_D1_N
HDMI_D1_P: U4.3(TMDS_D1+_SYS) ; port HDMI_D1_P
HDMI_D2_N: U4.2(TMDS_D2-_SYS) ; port HDMI_D2_N
HDMI_D2_P: U4.1(TMDS_D2+_SYS) ; port HDMI_D2_P
NetC22_1: C22.1 U4.26(ESD_BYPASS)
NetC23_1: C23.1 C70.2 FL22.1 U4.13(HDMI_5V0_CON) ; port HOTPLUG_I
NetC24_2: C24.2 FL22.2 J1.18(PWR)
NetFL23_2: FL23.2 J1.20(SHLD) J1.21(SHLD) J1.22(SHLD) J1.23(SHLD)
NetJ1_19: J1.19(DET) U4.12(HOTPLUG_CON)
NetR14_1: R14.1 U4.9(DDC_CLK_SYS) ; port DDC_CLK
NetR16_1: R16.1 U4.10(DDC_DAT_SYS) ; port DDC_DAT
NetTP12_TP: U4.28(ACTIVE) ; port HDMI_ACT
NetU4_29: U4.29(CEC_SYS) ; port CEC
NetU4_32: U4.32(HOTPLUG_CTRL) ; port HOTPLUG_O

Not connected (* = marked no-connect by the designer): J1 14(NC); U4 16(UTILITY_CON) 30(ENABLE_LDO) 31(NC)

### Layout directives
net class HDMI_CONN: HDMI_CON_CK_N, HDMI_CON_CK_P, HDMI_CON_D0_N, HDMI_CON_D0_P, HDMI_CON_D1_N, HDMI_CON_D1_P, HDMI_CON_D2_N, HDMI_CON_D2_P
differential pair: HDMI_CON_CK_N, HDMI_CON_CK_P, HDMI_CON_D0_N, HDMI_CON_D0_P, HDMI_CON_D1_N, HDMI_CON_D1_P, HDMI_CON_D2_N, HDMI_CON_D2_P

### Library data of the parts
C22 C66 C68 = GRM155R71C104KA88D: as C81 on sheet DrudePower; Published: 23-Apr-2014; Publisher: UltiMachine; LastRevisionDate: 23-Apr-2014; ManufacturerPartNumber: GRM155R71C104KA88D; VALUE: 100nF
C23 = GRM155R60J105KE19D: as C32 on sheet MCU; Published: 23-Apr-2014; Publisher: UltiMachine; LastRevisionDate: 23-Apr-2014; ManufacturerPartNumber: GRM155R60J105KE19D; VALUE: 1uF
C24 C67 C69 C70 = GRM155R71H103JA88D: as C71 on sheet LCD-Touch; Published: 10 - Dec - 2014; LatestRevisionDate: 10 - Dec - 2014; LatestRevisionNote: Ultimachine Footprint Added; Publisher: Ultimachine; Component Type: Chip Capacitor; MFR Part #: GRM155R71H103JA88D; Mounting Type: SMT 0402; Datasheet: http://search.murata.co.jp/Ceramy/image/img/A01X/G101/ENG/GRM155R71H103JA88-01.pdf; Height: 0.5 ±0.05mm; Digikey #: 490-7763-1-ND; PackageReference: 0402
FL22 FL23 = MPZ1608S221A: as FL1 on sheet DrudePower; Published: 23-Apr-2014; Publisher: UltiMachine; LastRevisionDate: 23-Apr-2014; Value: MPZ1608S221A
J1 = 10029449-111RLF: CONN HDMI RECPT 19POS SMT R/A
R14 R16 = R0402TBD: as R31 on sheet MCU; Published: 23-Apr-2014; Publisher: UltiMachine; LastRevisionDate: 23-Apr-2014; VALUE: R0402TBD
U4 = IP4787CZ32Y: IC DVI/HDMI ESD PROTECT 32HVQFN

## Nets that join several sheets
1.2V: DrudePower (C3.1 TP1.TP U5.1 U5.2), LCD-Touch (J4.5), TC358779XBG (FL10.1 FL11.1 FL12.1 FL14.1)
1.8V: DrudePower (C79.1 FL9.2), LCD-Touch (C4.1 C75.2 J4.1 J5.12)
3.3V: DrudePower (6 pins), LCD-Touch (5 pins), MCU (9 pins), TC358779XBG (5 pins), HDMI (5 pins)
5.5V: DrudePower (C74.1 FL4.2), LCD-Touch (C73.2 J4.3 J5.14 J5.16)
5V: DrudePower (7 pins), LCD-Touch (J4.4), MCU (C92.1 U9.2 U9.7), HDMI (C66.1 C67.2 U4.11)
-5.5V: DrudePower (C76.1 FL5.2), LCD-Touch (C71.2 J4.8 J5.18 J5.20)
GND: DrudePower (39 pins), LCD-Touch (17 pins), MCU (41 pins), TC358779XBG (63 pins), HDMI (15 pins)
VUSB: DrudePower (Q1.2 Q1.4 R6.2 R36.2), MCU (C62.1 C63.1 FL20.1 TP2.TP)
DSI_CLK_N: LCD-Touch (J5.17), TC358779XBG (U6.C9)
DSI_CLK_P: LCD-Touch (J5.19), TC358779XBG (U6.C10)
HDMI_CK_N: TC358779XBG (U6.C2), HDMI (U4.8)
HDMI_CK_P: TC358779XBG (U6.C1), HDMI (U4.7)
HDMI_D0_N: TC358779XBG (U6.D2), HDMI (U4.6)
HDMI_D0_P: TC358779XBG (U6.D1), HDMI (U4.5)
HDMI_D1_N: TC358779XBG (U6.E2), HDMI (U4.4)
HDMI_D1_P: TC358779XBG (U6.E1), HDMI (U4.3)
HDMI_D2_N: TC358779XBG (U6.F2), HDMI (U4.2)
HDMI_D2_P: TC358779XBG (U6.F1), HDMI (U4.1)
I2C_SCL: LCD-Touch (X1.5), MCU (J6.7 R27.1 TP20.TP U9.18), TC358779XBG (U6.J5)
I2C_SDA: LCD-Touch (X1.6), MCU (J6.9 R28.1 TP17.TP U9.19), TC358779XBG (U6.K5)
INT: LCD-Touch (R22.1 X1.7), MCU (TP18.TP U9.12)
LANE0_N: LCD-Touch (J5.11), TC358779XBG (U6.F9)
LANE0_P: LCD-Touch (J5.13), TC358779XBG (U6.F10)
LANE1_N: LCD-Touch (J5.23), TC358779XBG (U6.E9)
LANE1_P: LCD-Touch (J5.25), TC358779XBG (U6.E10)
LANE2_N: LCD-Touch (J5.29), TC358779XBG (U6.B9)
LANE2_P: LCD-Touch (J5.31), TC358779XBG (U6.B10)
LANE3_N: LCD-Touch (J5.5), TC358779XBG (U6.A9)
LANE3_P: LCD-Touch (J5.7), TC358779XBG (U6.A10)
LED-A: DrudePower (C9.1 D1.C TP9.TP), LCD-Touch (J5.8)
LED-K1: DrudePower (R10.1 R12.1 U3.3), LCD-Touch (J5.2)
LED-K2: DrudePower (R11.1), LCD-Touch (J5.4)
NetC23_1: TC358779XBG (U6.K3), HDMI (C23.1 C70.2 FL22.1 U4.13)
NetJ4_10: LCD-Touch (J4.10), MCU (TP11.TP U9.41)
NetJ5_28: LCD-Touch (J5.28), MCU (R21.2 R26.2 TP19.TP)
NetJ5_32: DrudePower (R13.1 R32.1), LCD-Touch (J5.32), MCU (R30.2 TP16.TP)
NetR14_1: TC358779XBG (U6.J1), HDMI (R14.1 U4.9)
NetR16_1: TC358779XBG (U6.J2), HDMI (R16.1 U4.10)
NetR29_1: DrudePower (R29.1 R34.1 TP10.TP), MCU (U9.26)
NetTP12_TP: MCU (TP12.TP U9.40), HDMI (U4.28)
NetTP13_TP: MCU (TP13.TP U9.39), TC358779XBG (U6.K4)
NetTP14_TP: MCU (TP14.TP U9.1), TC358779XBG (U6.J4)
NetTP15_TP: MCU (TP15.TP U9.32), TC358779XBG (U6.K6)
NetU4_29: TC358779XBG (U6.H2), HDMI (U4.29)
NetU4_32: TC358779XBG (U6.J3), HDMI (U4.32)
RESET_TOUCH: LCD-Touch (R23.1 X1.4), MCU (U9.22)

## Assembly variants
Default: not fitted C12 C72 C75 R10 R13 R32 R34